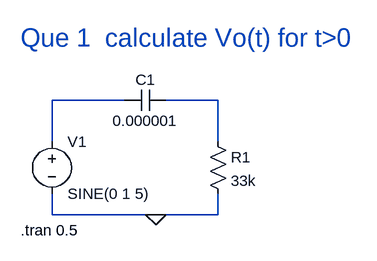
[diagram p0: schematic 1_Dheerendra_23EE019_AC_Transient.asc]
1_Dheerendra_23EE019_AC_Transient.asc, the LTspice schematic file:
Version 4
SHEET 1 880 680
WIRE 144 64 32 64
WIRE 288 64 208 64
WIRE 32 128 32 64
WIRE 288 128 288 64
WIRE 32 240 32 208
WIRE 192 240 32 240
WIRE 288 240 288 208
WIRE 288 240 192 240
FLAG 192 240 0
SYMBOL res 272 112 R0
SYMATTR InstName R1
SYMATTR Value 33k
SYMBOL voltage 32 112 R0
WINDOW 123 0 0 Left 0
WINDOW 39 0 0 Left 0
SYMATTR InstName V1
SYMATTR Value SINE(0 1 5)
SYMBOL cap 208 48 R90
WINDOW 0 0 32 VBottom 2
WINDOW 3 32 32 VTop 2
SYMATTR InstName C1
SYMATTR Value 0.000001
TEXT -16 -32 Left 4 ;Que 1  calculate Vo(t) for t>0
TEXT -16 264 Left 2 !.tran 0.5

The netlist it stands for:
* 1_Dheerendra_23EE019_AC_Transient.asc
R1 N002 0 33k
V1 N001 0 SINE(0 1 5)
C1 N002 N001 0.000001
* Que 1  calculate Vo(t) for t>0
.tran 0.5
.backanno
.end